# EAGLE design Home control v0 (EAGLE 9.6.2)
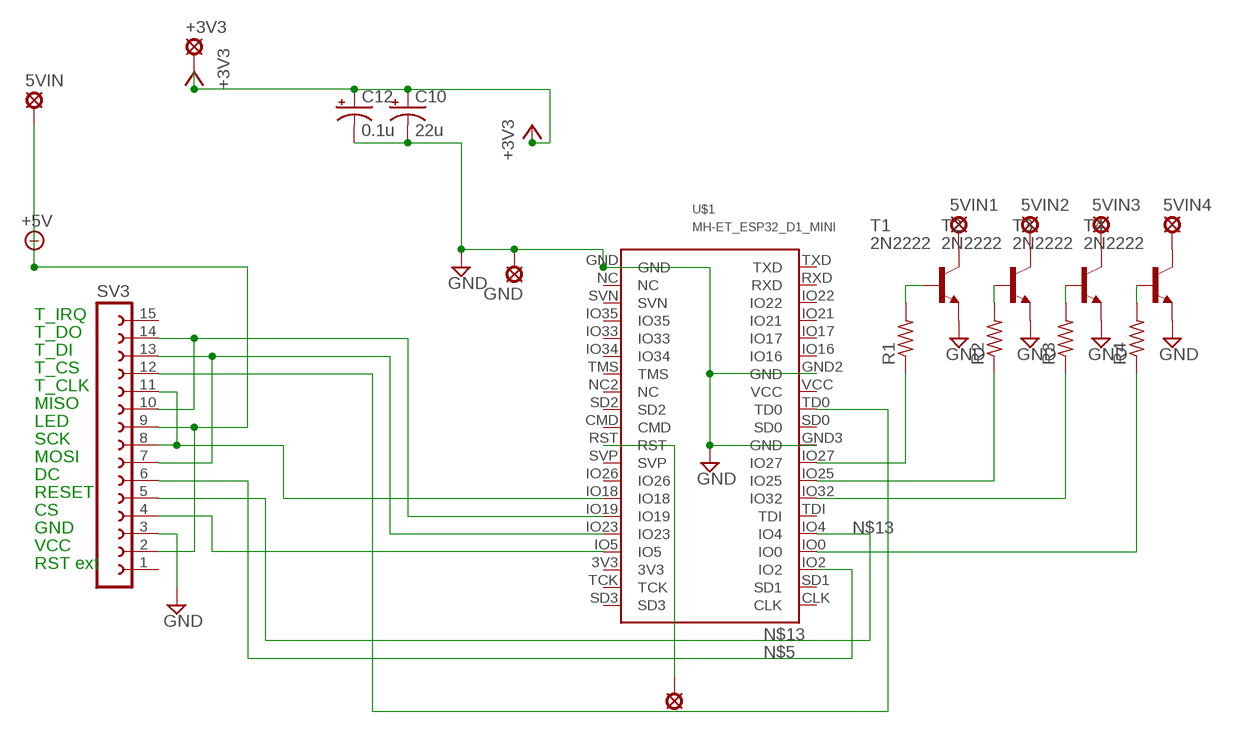
[diagram p0: schematic, sheet 1]

## Parts
5VIN  LSP10  [LSP10]
5VIN1  LSP10  [LSP10]
5VIN2  LSP10  [LSP10]
5VIN3  LSP10  [LSP10]
5VIN4  LSP10  [LSP10]
+3V3  LSP10  [LSP10]
C10  22u  CPOL-USE3.5-8  [E3,5-8]
C12  0.1u  CPOL-USE2-5  [E2-5]
GND  LSP10  [LSP10]
R1  R-US_R0603  [R0603]
R2  R-US_R0603  [R0603]
R3  R-US_R0603  [R0603]
R4  R-US_R0603  [R0603]
RST  LSP10  [LSP10]
SV3  FE15-1  [FE15]
T1  2N2222  [TO92-EBC-OVAL]
T2  2N2222  [TO92-EBC-OVAL]
T3  2N2222  [TO92-EBC-OVAL]
T4  2N2222  [TO92-EBC-OVAL]
U$1  MH-ET_ESP32_D1_MINI  [MH-ET_ESP32_D1_MINI]

## Nets
+3V3 [Supply]: +3V3.MP C10.+ C12.+
+5V [Supply]: 5VIN.MP SV3.2 SV3.9
GND: C10.- C12.- GND.MP SV3.3 T1.E T2.E T3.E T4.E U$1.GND U$1.GND2(GND) U$1.GND3(GND)
N$1: R1.2 T1.B
N$2: SV3.10 SV3.14 U$1.IO19
N$3: SV3.7 SV3.13 U$1.IO23
N$4: R2.2 T2.B
N$5: SV3.6 U$1.IO2
N$6: SV3.12 U$1.TD0
N$7: R3.2 T3.B
N$8: SV3.8 SV3.11 U$1.IO18
N$9: R4.2 T4.B
N$10: SV3.4 U$1.IO5
N$11: R1.1 U$1.IO27
N$12: R2.1 U$1.IO25
N$13: SV3.5 U$1.IO4
N$14: R3.1 U$1.IO32
N$15: 5VIN1.MP T1.C
N$16: 5VIN2.MP T2.C
N$17: 5VIN3.MP T3.C
N$18: 5VIN4.MP T4.C
N$27: R4.1 U$1.IO0
N$48: RST.MP U$1.RST
Unconnected: SV3.1 SV3.15 U$1.3V3 U$1.CLK U$1.CMD U$1.IO16 U$1.IO17 U$1.IO21 U$1.IO22 U$1.IO26 U$1.IO33 U$1.IO34 U$1.IO35 U$1.NC U$1.NC2(NC) U$1.RXD U$1.SD0 U$1.SD1 U$1.SD2 U$1.SD3 U$1.SVN U$1.SVP U$1.TCK U$1.TDI U$1.TMS U$1.TXD U$1.VCC

## Notes on the sheet
- T_IRQ
- T_DO
- T_DI
- T_CS
- T_CLK
- MISO
- LED
- SCK
- MOSI
- DC
- RESET
- CS
- GND
- VCC
- RST ext

## Library data of the parts
5VIN 5VIN1-5VIN4 +3V3 GND RST = solpad:LSP10: SOLDER PAD drill 1.0 mm, distributor Buerklin, 12H555
C10 C12 = adafruit:CPOL-US: POLARIZED CAPACITOR, American symbol
R1-R4 = rcl:R-US_: RESISTOR, American symbol; SPICEPREFIX: R
SV3 = con-lsta:FE15-1: FEMALE HEADER; OC_FARNELL: unknown; OC_NEWARK: unknown
T1-T4 = adafruit:2N2222: NPN TRANSISTOR Big oval pads
U$1 = MH-ET_ESP32_D1_MINI:MH-ET_ESP32_D1_MINI

## Net classes
0 default: width 0.508 mm
1 Supply: width 1.016 mm
2 HiAmp: width 1.524 mm, drill 0.254 mm, clearance 0.254 mm
4 Digital: width 0.254 mm

## Board
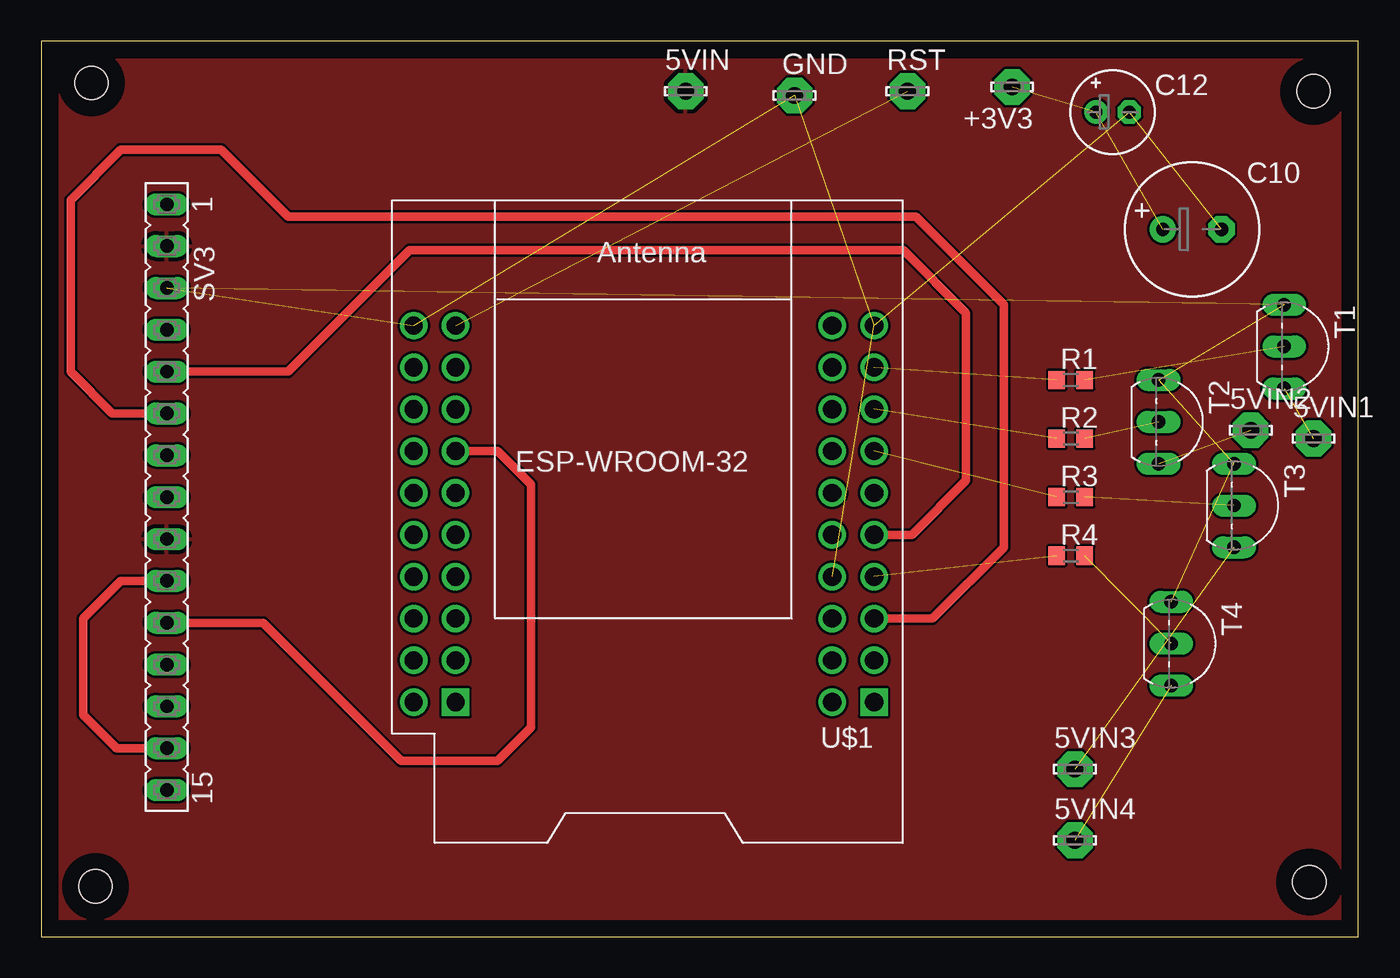
[diagram p1: board, top side]
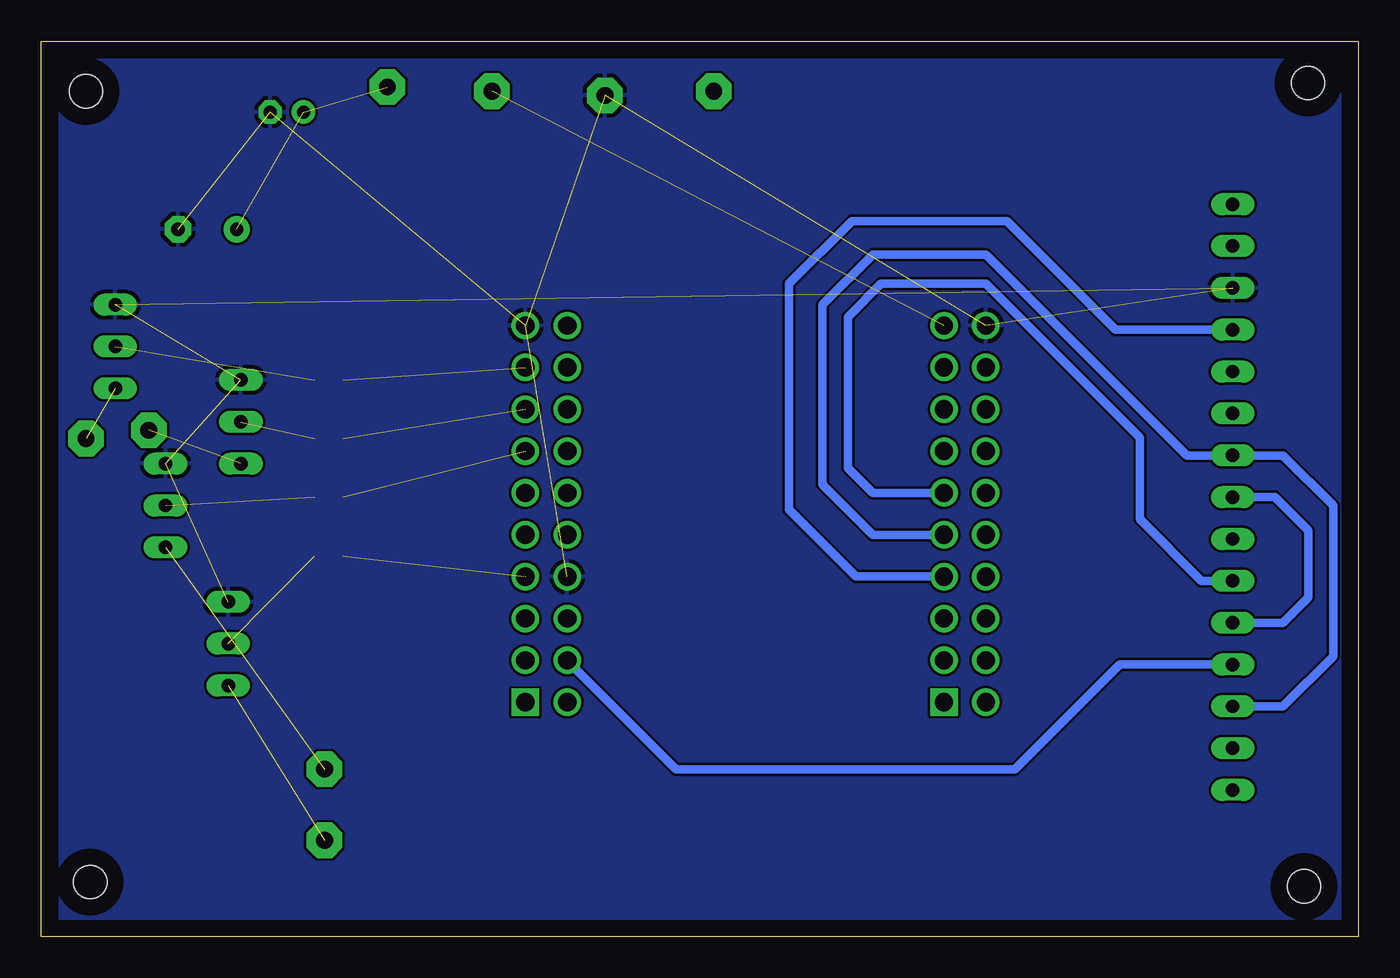
[diagram p2: board, bottom side, seen from below]

Size 79.93 x 54.35 mm. Coordinates in mm from the lower left corner, seen from the top.
Outline: 0,0 79.93,0 79.93,54.35 0,54.35 0,0
Copper layers (1*16): Top 0.035mm / dielectric 1.5mm / Bottom 0.035mm
Design rules "default": minimum track width 6mil, minimum drill 0.35mm, track to track 6mil, track to pad 6mil, pad to pad 6mil, via to via 6mil, smd to smd 6mil, copper to edge 40mil, drill to drill 6mil, minimum pad ring 10mil, minimum via ring 8mil, stop-mask expansion 4mil, vias tented up to drill 0mil, thermal gap 10mil
Holes 2 mm at 3.05,51.82 77.22,51.31 3.3,3.05 76.96,3.3

### Footprints (pad centres in the part's own frame; a part is rotated, then mirrored left to right if it is on the bottom)
LSP10 = drill 1.016 pad 2.159 octagon: MP 0,0
E3,5-8 = drill 0.813 pad 1.6: + -1.778,0 | drill 0.813 pad 1.6 octagon: - 1.778,0
E2-5 = drill 0.813 pad 1.422: + -1.016,0 | drill 0.813 pad 1.422 octagon: - 1.016,0
R0603 = smd 1 x 1.1: 1 -0.85,0; 2 0.85,0
FE15 = drill 0.813 long: 1 -17.78,0; 2 -15.24,0; 3 -12.7,0; 4 -10.16,0; 5 -7.62,0; 6 -5.08,0; 7 -2.54,0; 8 0,0; 9 2.54,0; 10 5.08,0; 11 7.62,0; 12 10.16,0; 13 12.7,0; 14 15.24,0; 15 17.78,0
TO92-EBC-OVAL = drill 0.813 long: B 0,-1.27; C 2.54,-1.27; E -2.54,-1.27
MH-ET_ESP32_D1_MINI = drill 1.11 pad 1.665: 3V3 25.4,-5.08; CMD 27.94,0; GND 0,-22.86; GND2 2.54,-7.62; GND3 27.94,-22.86; IO0 0,-7.62; IO2 0,-5.08; IO4 0,-10.16; IO5 25.4,-7.62; IO16 2.54,-10.16; IO17 2.54,-12.7; IO18 25.4,-15.24; IO19 25.4,-12.7; IO21 2.54,-15.24; IO22 2.54,-17.78; IO23 25.4,-10.16; IO25 0,-17.78; IO26 25.4,-17.78; IO27 0,-20.32; IO32 0,-15.24; IO33 27.94,-12.7; IO34 27.94,-10.16; IO35 27.94,-15.24; NC 27.94,-20.32; NC2 27.94,-5.08; RST 25.4,-22.86; RXD 2.54,-20.32; SD0 2.54,0; SD1 0,-2.54; SD2 27.94,-2.54; SVN 27.94,-17.78; SVP 25.4,-20.32; TCK 25.4,-2.54; TD0 2.54,-2.54; TDI 0,-12.7; TMS 27.94,-7.62; TXD 2.54,-22.86; VCC 2.54,-5.08 | drill 1.11 pad 1.665 square: CLK 0,0; SD3 25.4,0

### Placement (x,y rotation side)
5VIN  39.12,51.31 0 top
5VIN1  77.22,30.23 0 top
5VIN2  73.41,30.73 0 top
5VIN3  62.74,10.16 0 top
5VIN4  62.74,5.84 0 top
+3V3  58.93,51.56 180 top
C10  69.85,42.93 0 top
C12  65.02,50.04 0 top
GND  45.72,51.05 0 top
R1  62.48,33.78 0 top
R2  62.48,30.23 0 top
R3  62.48,26.67 0 top
R4  62.48,23.11 0 top
RST  52.58,51.31 0 top
SV3  7.62,26.67 270 top
T1  76.71,35.81 270 top
T2  69.09,31.24 270 top
T3  73.66,26.16 270 top
T4  69.85,17.78 270 top
U$1  50.55,14.22 180 top

### Tracks (layer width: path | path; a pad name or v marks a point on that pad's centre or on a via)
+3V3  (2 unrouted)
+5V
  pour Top: 1.02,53.59 78.99,53.59 79.25,53.85 79.25,0.51 0.76,0.51 0.51,0.76 0.51,53.34 0.76,53.59
GND  (10 unrouted)
  pour Bottom: 0.76,53.85 79.5,53.85 79.5,0.76 0.76,0.76 0.76,53.59 0.51,53.85
N$1  (1 unrouted)
N$2
  Top 0.508: SV3.14 4.57,11.43 2.54,13.46 2.54,19.3 4.83,21.59 SV3.10
  Bottom 0.508: U$1.IO19 29.46,26.92 30.99,28.45 30.99,37.59 28.96,39.62 22.61,39.62 13.27,30.29 13.27,25.34 9.53,21.59 SV3.10
N$3
  Bottom 0.508: U$1.IO23 29.46,24.38 32.51,27.43 32.51,38.35 29.46,41.4 22.61,41.4 10.41,29.21 SV3.7 4.57,29.21 1.52,26.16 1.52,17.02 4.57,13.97 SV3.13
N$4  (1 unrouted)
N$5
  Top 0.508: 7.87,31.75 SV3.6 4.32,31.75 1.78,34.29 1.78,44.7 4.83,47.75 10.92,47.75 14.99,43.69 53.09,43.69 58.42,38.35 58.42,23.62 54.1,19.3 U$1.IO2
N$6
  Bottom 0.508: SV3.12 14.48,16.51 20.83,10.16 41.4,10.16 U$1.TD0
N$7  (1 unrouted)
N$8
  Top 0.508: U$1.IO18 27.69,29.46 29.72,27.43 29.72,12.7 27.69,10.67 21.84,10.67 13.46,19.05 SV3.11
  Bottom 0.508: SV3.11 4.57,19.05 3.05,20.57 3.05,24.64 5.08,26.67 SV3.8
N$9  (1 unrouted)
N$10
  Bottom 0.508: U$1.IO5 30.48,21.84 34.54,25.91 34.54,39.62 30.73,43.43 21.34,43.43 14.73,36.83 SV3.4
N$11  (1 unrouted)
N$12  (1 unrouted)
N$13
  Top 0.508: SV3.5 14.99,34.29 22.35,41.66 52.32,41.66 56.13,37.85 56.13,27.69 52.83,24.38 U$1.IO4
N$14  (1 unrouted)
N$15  (1 unrouted)
N$16  (1 unrouted)
N$17  (1 unrouted)
N$18  (1 unrouted)
N$27  (1 unrouted)
N$48  (1 unrouted)